# Altium project dalibor-display.PrjPcb
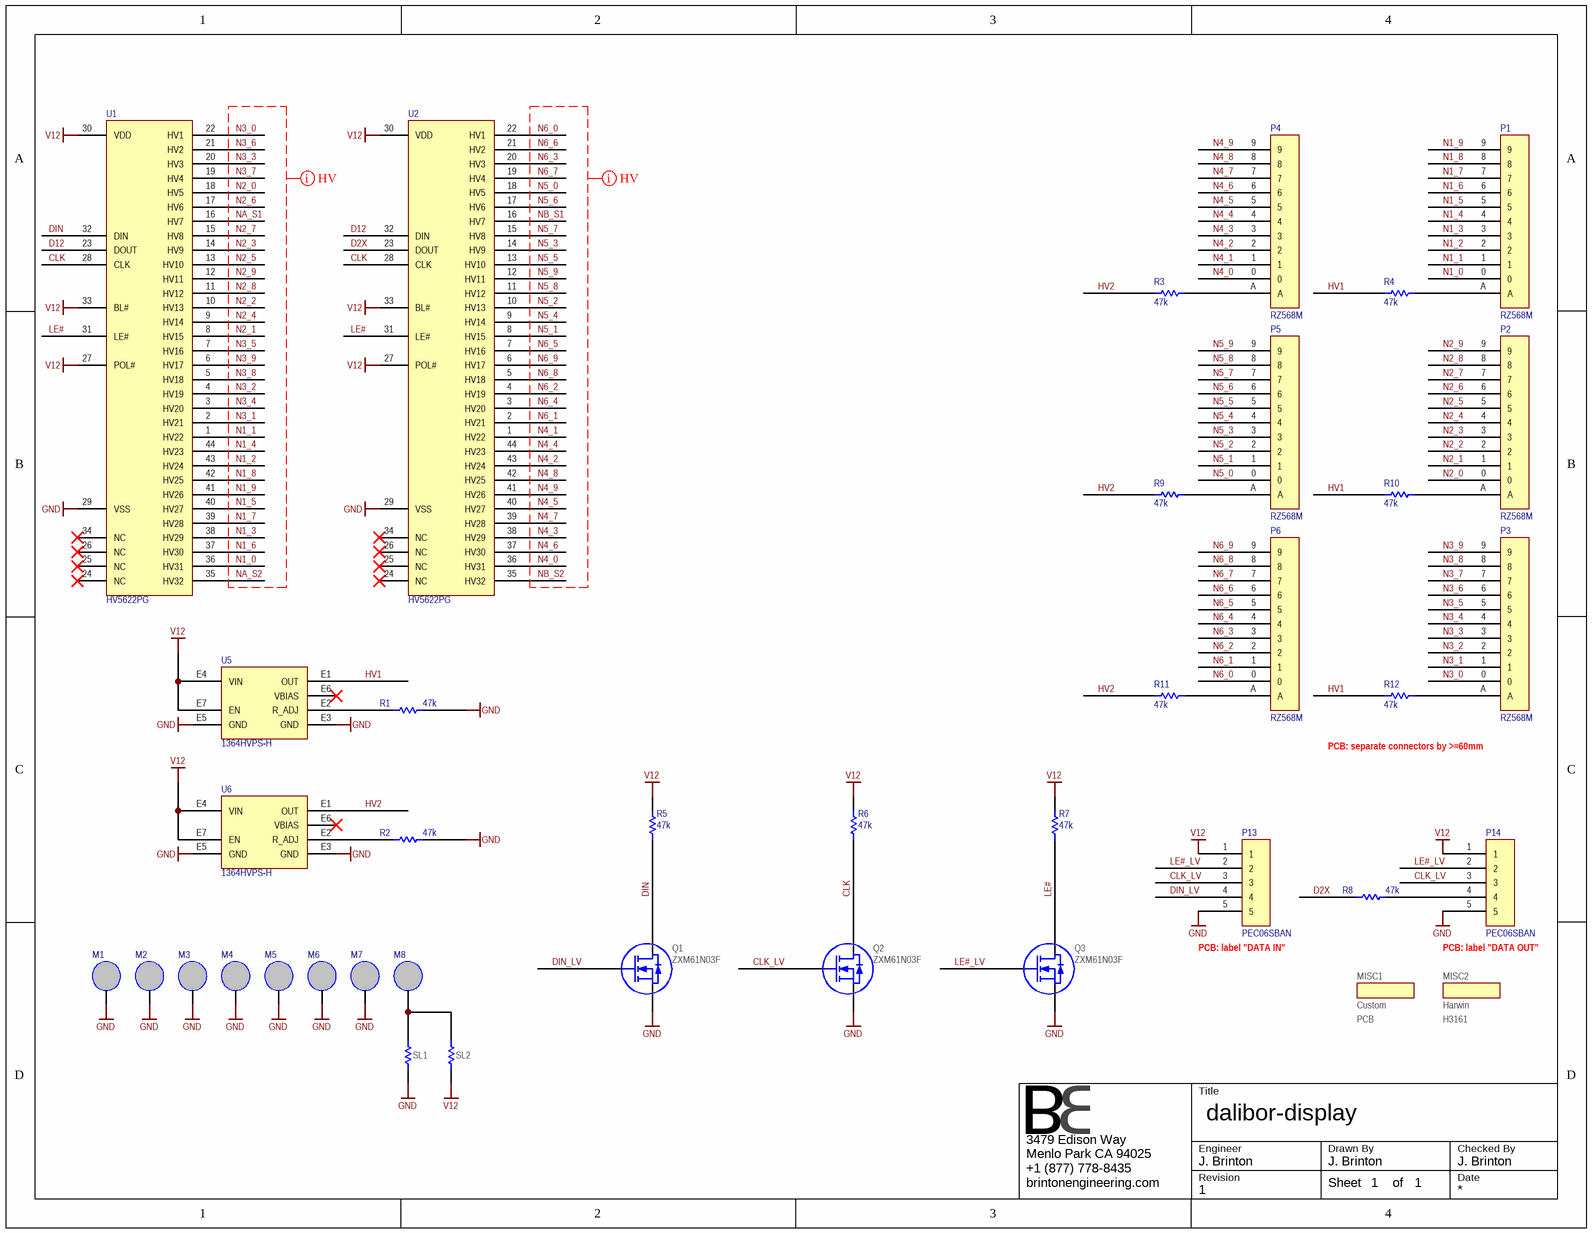
[diagram p0: dalibor-display.SchDoc]
Revision: 2.0; Release: 1; QualityByDate: N/A; QualityBy: N/A; ManagerDate: N/A; Manager: N/A; EngineerDate: 11/6/2019; Engineer: J. Brinton; DrawnByDate: 11/6/2019; DrawnBy: J. Brinton; CompanyEmail: maybe.i.reply@amaya.tech; CompanyAddress: Lafayette, California; Company: Amaya Tech, Inc.; ClientProject: Dalibor Display (2-Tube); ClientAddress: Lafayette, California; Client: Amaya Tech, Inc.; CheckedByDate: N/A; CheckedBy: N/A
1 sheet, 39 parts. Net scope: global (net labels, ports and power ports of the same name join across sheets).
Board file: dalibor-display.PcbDoc

## Sheet dalibor-display.SchDoc: dalibor-display
size Letter; CheckedBy: J. Brinton; CompanyName: Signal Laboratories, Inc.; DrawnBy: J. Brinton; Engineer: J. Brinton; Address1: 3479 Edison Way; Address2: Menlo Park CA 94025; Address3: +1 (877) 778-8435; Address4: brintonengineering.com; Revision: 1; SheetNumber: 1; SheetTotal: 1

### Parts
M1  MOUNT  [MOUNT1-4_20]  (value not drawn)  (no BOM)
M2  MOUNT  [MOUNT1-4_20]  (value not drawn)  (no BOM)
M3  MOUNT  [MOUNT1-4_20]  (value not drawn)  (no BOM)
M4  MOUNT  [MOUNT1-4_20]  (value not drawn)  (no BOM)
M5  MOUNT  [MOUNT1-4_20]  (value not drawn)  (no BOM)
M6  MOUNT  [MOUNT1-4_20]  (value not drawn)  (no BOM)
M7  MOUNT  [MOUNT1-4_20]  (value not drawn)  (no BOM)
M8  MOUNT  [MOUNT1-4_20]  (value not drawn)  (no BOM)
MISC1  PCB  Manufacturer: Custom  (mechanical)
MISC2  H3161  Manufacturer: Harwin  (mechanical)
P1  RZ568M  [RZ568M]
P2  RZ568M  [RZ568M]
P3  RZ568M  [RZ568M]
P4  RZ568M  [RZ568M]
P5  RZ568M  [RZ568M]
P6  RZ568M  [RZ568M]
P13  PEC06SBAN  [HDR1X5]
P14  PEC06SBAN  [HDR1X5]
Q1  ZXM61N03F  [SOT23]
Q2  ZXM61N03F  [SOT23]
Q3  ZXM61N03F  [SOT23]
R1  value 47k  [0805]  (hidden comment: ERJ-6ENF4702V)
R2  value 47k  [0805]  (hidden comment: ERJ-6ENF4702V)
R3  value 47k  [0805]  (hidden comment: ERJ-6ENF4702V)
R4  value 47k  [0805]  (hidden comment: ERJ-6ENF4702V)
R5  value 47k  [0805]  (hidden comment: ERJ-6ENF4702V)
R6  value 47k  [0805]  (hidden comment: ERJ-6ENF4702V)
R7  value 47k  [0805]  (hidden comment: ERJ-6ENF4702V)
R8  value 47k  [0805]  (hidden comment: ERJ-6ENF4702V)
R9  value 47k  [0805]  (hidden comment: ERJ-6ENF4702V)
R10  value 47k  [0805]  (hidden comment: ERJ-6ENF4702V)
R11  value 47k  [0805]  (hidden comment: ERJ-6ENF4702V)
R12  value 47k  [0805]  (hidden comment: ERJ-6ENF4702V)
SL1  SOLDER_LINK  [SOLDERLINK0603X26N]  (value not drawn)  (no BOM)
SL2  SOLDER_LINK  [SOLDERLINK0603X26N]  (value not drawn)  (no BOM)
U1  HV5622PG  [QFP44P80_1390X1390X235L88X37N]
U2  HV5622PG  [QFP44P80_1390X1390X235L88X37N]
U5  1364HVPS-H  [1364HVPS-H]
U6  1364HVPS-H  [1364HVPS-H]

### Nets
GND: M1.1(MNT) M2.1(MNT) M3.1(MNT) M4.1(MNT) M5.1(MNT) M6.1(MNT) M7.1(MNT) P13.5 P14.5 Q1.2(S) Q2.2(S) Q3.2(S) R1.2 R2.2 SL1.2 U1.29(VSS) U2.29(VSS) U5.E3(GND) U5.E5(GND) U6.E3(GND) U6.E5(GND)
V12: P13.1 P14.1 R5.2 R6.2 R7.2 SL2.2 U1.27(POL#) U1.30(VDD) U1.33(BL#) U2.27(POL#) U2.30(VDD) U2.33(BL#) U5.E4(VIN) U5.E7(EN) U6.E4(VIN) U6.E7(EN)
CLK: Q2.3(D) R6.1 U1.28(CLK) U2.28(CLK)
CLK_LV: P13.3 P14.3 Q2.1(G)
D2X: R8.1 U2.23(DOUT)
D12: U1.23(DOUT) U2.32(DIN)
DIN: Q1.3(D) R5.1 U1.32(DIN)
DIN_LV: P13.4 Q1.1(G)
HV1: R4.2 R10.2 R12.2 U5.E1(OUT)
HV2: R3.2 R9.2 R11.2 U6.E1(OUT)
LE#: Q3.3(D) R7.1 U1.31(LE#) U2.31(LE#)
LE#_LV: P13.2 P14.2 Q3.1(G)
N1_0: P1.0 U1.36(HV31)
N1_1: P1.1 U1.1(HV22)
N1_2: P1.2 U1.43(HV24)
N1_3: P1.3 U1.38(HV29)
N1_4: P1.4 U1.44(HV23)
N1_5: P1.5 U1.40(HV27)
N1_6: P1.6 U1.37(HV30)
N1_7: P1.7 U1.39(HV28)
N1_8: P1.8 U1.42(HV25)
N1_9: P1.9 U1.41(HV26)
N2_0: P2.0 U1.18(HV5)
N2_1: P2.1 U1.8(HV15)
N2_2: P2.2 U1.10(HV13)
N2_3: P2.3 U1.14(HV9)
N2_4: P2.4 U1.9(HV14)
N2_5: P2.5 U1.13(HV10)
N2_6: P2.6 U1.17(HV6)
N2_7: P2.7 U1.15(HV8)
N2_8: P2.8 U1.11(HV12)
N2_9: P2.9 U1.12(HV11)
N3_0: P3.0 U1.22(HV1)
N3_1: P3.1 U1.2(HV21)
N3_2: P3.2 U1.4(HV19)
N3_3: P3.3 U1.20(HV3)
N3_4: P3.4 U1.3(HV20)
N3_5: P3.5 U1.7(HV16)
N3_6: P3.6 U1.21(HV2)
N3_7: P3.7 U1.19(HV4)
N3_8: P3.8 U1.5(HV18)
N3_9: P3.9 U1.6(HV17)
N4_0: P4.0 U2.36(HV31)
N4_1: P4.1 U2.1(HV22)
N4_2: P4.2 U2.43(HV24)
N4_3: P4.3 U2.38(HV29)
N4_4: P4.4 U2.44(HV23)
N4_5: P4.5 U2.40(HV27)
N4_6: P4.6 U2.37(HV30)
N4_7: P4.7 U2.39(HV28)
N4_8: P4.8 U2.42(HV25)
N4_9: P4.9 U2.41(HV26)
N5_0: P5.0 U2.18(HV5)
N5_1: P5.1 U2.8(HV15)
N5_2: P5.2 U2.10(HV13)
N5_3: P5.3 U2.14(HV9)
N5_4: P5.4 U2.9(HV14)
N5_5: P5.5 U2.13(HV10)
N5_6: P5.6 U2.17(HV6)
N5_7: P5.7 U2.15(HV8)
N5_8: P5.8 U2.11(HV12)
N5_9: P5.9 U2.12(HV11)
N6_0: P6.0 U2.22(HV1)
N6_1: P6.1 U2.2(HV21)
N6_2: P6.2 U2.4(HV19)
N6_3: P6.3 U2.20(HV3)
N6_4: P6.4 U2.3(HV20)
N6_5: P6.5 U2.7(HV16)
N6_6: P6.6 U2.21(HV2)
N6_7: P6.7 U2.19(HV4)
N6_8: P6.8 U2.5(HV18)
N6_9: P6.9 U2.6(HV17)
NA_S1: U1.16(HV7)
NA_S2: U1.35(HV32)
NB_S1: U2.16(HV7)
NB_S2: U2.35(HV32)
NetM8_1: M8.1(MNT) SL1.1 SL2.1
NetP1_A: P1.A R4.1
NetP2_A: P2.A R10.1
NetP3_A: P3.A R12.1
NetP4_A: P4.A R3.1
NetP5_A: P5.A R9.1
NetP6_A: P6.A R11.1
NetP14_4: P14.4 R8.2
NetR1_1: R1.1 U5.E2(R_ADJ)
NetR2_1: R2.1 U6.E2(R_ADJ)

Not connected (* = marked no-connect by the designer): U1 24(NC)* 25(NC)* 26(NC)* 34(NC)*; U2 24(NC)* 25(NC)* 26(NC)* 34(NC)*; U5 E6(VBIAS)*; U6 E6(VBIAS)*

### Layout directives
net class HV: N1_0, N1_1, N1_2, N1_3, N1_4, N1_5, N1_6, N1_7, N1_8, N1_9, N2_0, N2_1, N2_2, N2_3, N2_4, N2_5, N2_6, N2_7, N2_8, N2_9, N3_0, N3_1, N3_2, N3_3, N3_4, N3_5, N3_6, N3_7, N3_8, N3_9, N4_0, N4_1, N4_2, N4_3, N4_4, N4_5, N4_6, N4_7, N4_8, N4_9, N5_0, N5_1, N5_2, N5_3, N5_4, N5_5, N5_6, N5_7, N5_8, N5_9, N6_0, N6_1, N6_2, N6_3, N6_4, N6_5, N6_6, N6_7, N6_8, N6_9, NA_S1, NA_S2, NB_S1, NB_S2

### Notes on the sheet
- PCB: separate connectors by >=60mm
- (near P13) PCB: label "DATA IN"
- PCB: label "DATA OUT"
- Title
- Engineer
- Revision
- Drawn By
- Checked By
- Date
- Sheet
- of

### Library data of the parts
MISC1 = M50-1900005: Do Not Place: PURCHASE BUT DNP; Manufacturer P/N: Custom
MISC2 = M50-1900005: Pin Receptacle; Do Not Place: PURCHASE QTY. 66 AND HAND SOLDER; Manufacturer P/N: H3161
P1-P6 = RZ568M: Nixie Tube Socket; Manufacturer: Glow Tube Research; Manufacturer P/N: RZ568M
P13 P14 = PEC06SBAN: Header, 5-Pin, Right Angle, 0.1" pitch; Manufacturer: Sullins; Manufacturer P/N: PEC06SBAN
Q1-Q3 = BSH103: N-Channel Enhancement Mode MOSFET transistor; Manufacturer: Zetex; Manufacturer P/N: ZXM61N03F
R1-R12 = RES: Thick Film Resistor 47k +/-1% 0805; Manufacturer: Panasonic; Tcr: *; Tolerance: *; Manufacturer P/N: ERJ-6ENF4702V; Tr: *; Alternatives: *; Voltage: *; Power: *; Footprint: *
SL1 SL2 = RES: Solder Link; Manufacturer P/N: *; Manufacturer: *
U1 U2 = HV5622PG: 32-Channel Serial to Parallel Converter; Manufacturer: Microchip; Manufacturer P/N: HV5622PG
U5 U6 = 1364HVPS-H: High Voltage Power Supply; Manufacturer: Taylor Electronics; Manufacturer P/N: 1364HVPS-H
M1-M8 = MOUNT: Manufacturer: *; Manufacturer P/N: *